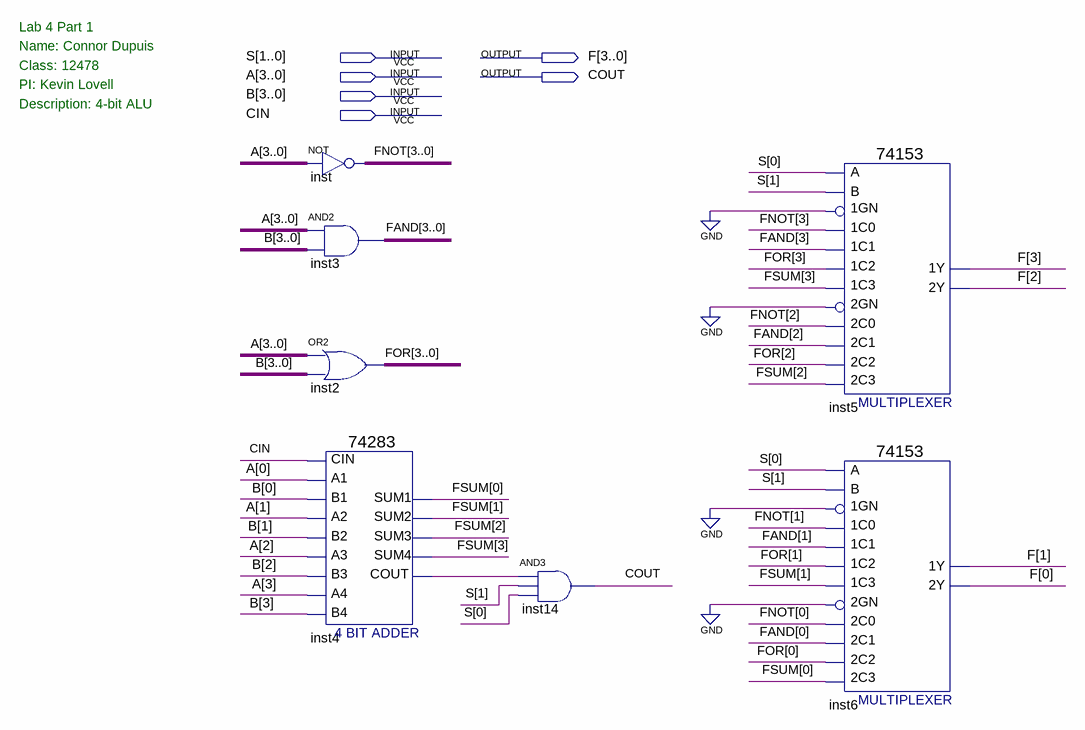
[diagram p0: schematic sheet]
// Quartus schematic Lab4_ALU.bdf as structural Verilog: 7 symbols, 6 pins
module Lab4_ALU (
  input  [1:0] S,
  input  [3:0] A,
  input  [3:0] B,
  input  CIN,
  output [3:0] F,
  output COUT
);

  wire inst4_cout;
  wire [3:0] FAND, FNOT, FOR, FSUM;

  assign FNOT = ~A;  // NOT inst, 4 bits wide
  assign FAND = A & B;  // AND2 inst3, 4 bits wide
  assign FOR = A | B;  // OR2 inst2, 4 bits wide
  \74283  inst4 (
    .CIN(CIN), .A1(A[0]), .A2(A[1]), .B2(B[1]), .A3(A[2]), .A4(A[3]), .B4(B[3]), .B1(B[0]), .B3(B[2]),
    .SUM4(FSUM[3]), .COUT(inst4_cout), .SUM1(FSUM[0]), .SUM2(FSUM[1]), .SUM3(FSUM[2]));
  and inst14 (COUT, inst4_cout, S[1], S[0]);
  \74153  inst5 (
    .\1C1 (FAND[3]), .\1GN (1'b0), .\1C0 (FNOT[3]), .\2C0 (FNOT[2]), .\2GN (1'b0), .\2C2 (FOR[2]),
    .\1C2 (FOR[3]), .\1C3 (FSUM[3]), .B(S[1]), .A(S[0]), .\2C1 (FAND[2]), .\2C3 (FSUM[2]), .\1Y (F[3]),
    .\2Y (F[2]));
  \74153  inst6 (
    .\1C1 (FAND[1]), .\1GN (1'b0), .\1C0 (FNOT[1]), .\2C0 (FNOT[0]), .\2GN (1'b0), .\2C2 (FOR[0]),
    .\1C2 (FOR[1]), .\1C3 (FSUM[1]), .B(S[1]), .A(S[0]), .\2C1 (FAND[0]), .\2C3 (FSUM[0]), .\1Y (F[1]),
    .\2Y (F[0]));

  // Notes on the sheet:
  //   Lab 4 Part 1
  //   Name: Connor Dupuis
  //   Class: 12478
  //   PI: Kevin Lovell
  //   Description: 4-bit ALU
endmodule
